# EAGLE design boost (EAGLE 7.5.0)
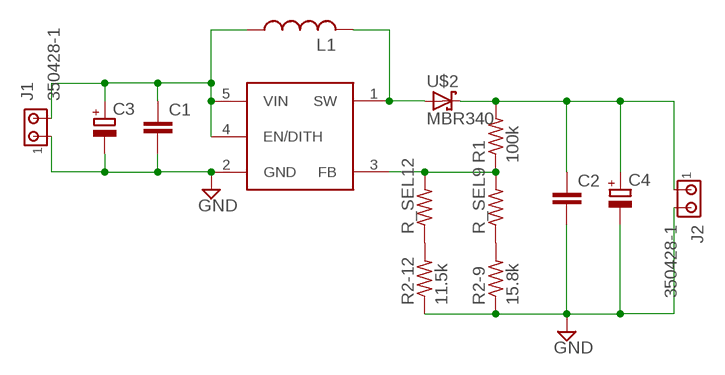
[diagram p0: schematic, sheet 1]

## Parts
C1  C-EUC3216  [C3216]
C2  C-EUC3216  [C3216]
C3  CPOL-EUE1.8-4  [E1,8-4]
C4  CPOL-EUE1.8-4  [E1,8-4]
J1  350428-1  [350428-1]
J2  350428-1  [350428-1]
L1  L-US6000-XXX-RC  [6000-XXXX-RC]
R1  100k  R-US_M0805  [M0805]
R2-9  15.8k  R-US_M0805  [M0805]
R2-12  11.5k  R-US_M0805  [M0805]
R_SEL9  R-US_R0402  [R0402]
R_SEL12  R-US_R0402  [R0402]
U$1  MIC2250-2YD5  [SOT23-5]
U$2  MBR340  [MBR340-V]

## Nets
GND: C1.2 C2.2 C3.- C4.- J1.1 J2.2 R2-9.1 R2-12.1 U$1.2(GND)
N$2: L1.2 U$1.1(SW) U$2.P$1(A)
N$5: R1.1 R_SEL9.2 R_SEL12.2 U$1.3(FB)
N$6: R2-12.2 R_SEL12.1
N$7: R2-9.2 R_SEL9.1
VIN: C1.1 C3.+ J1.2 L1.1 U$1.4(EN/DITH) U$1.5(VIN)
VOUT: C2.1 C4.+ J2.1 R1.2 U$2.P$2(C)

## Library data of the parts
C1 C2 = rcl:C-EU: CAPACITOR, European symbol
C3 C4 = rcl:CPOL-EU: POLARIZED CAPACITOR, European symbol
J1 J2 = con-amp:350428-1: Universal MATE-N-LOK .250" Centerline, 600 V, 19 - 36 A max Source: http://catalog.tycoelectronics.com/ .. ENG_CD_350428_Y.pdf
L1 = rcl:L-US: INDUCTOR, American symbol
R1 R2-9 R2-12 R_SEL9 R_SEL12 = rcl:R-US_: RESISTOR, American symbol
U$1 = pol:MIC2250-2YD5
U$2 = pol:MBR340: Shottky diode 3A

## Board
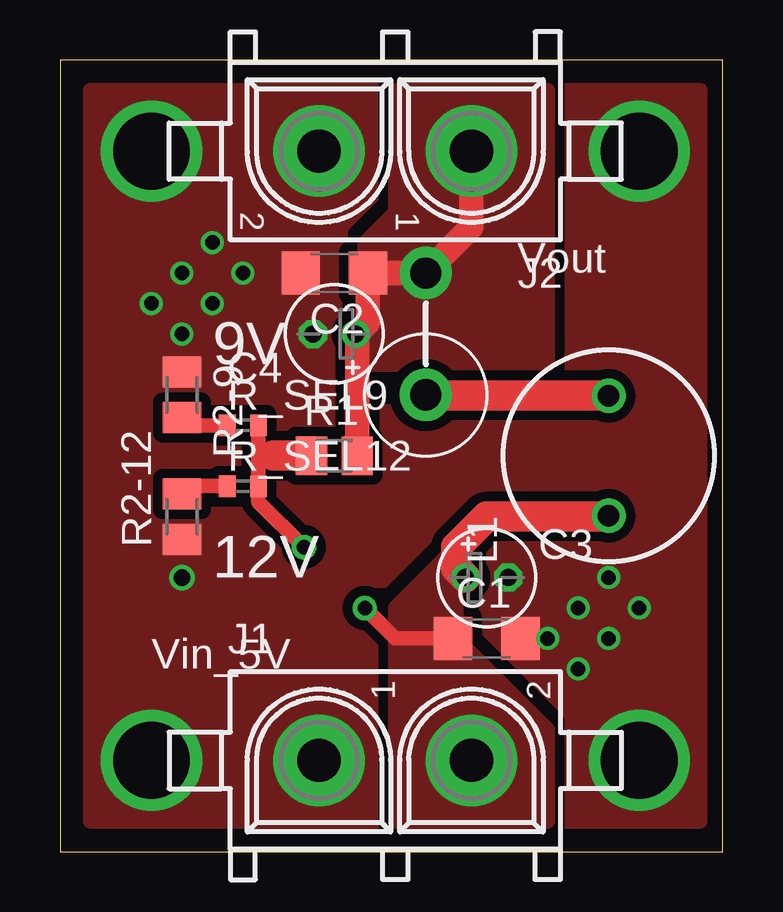
[diagram p1: board, top side]
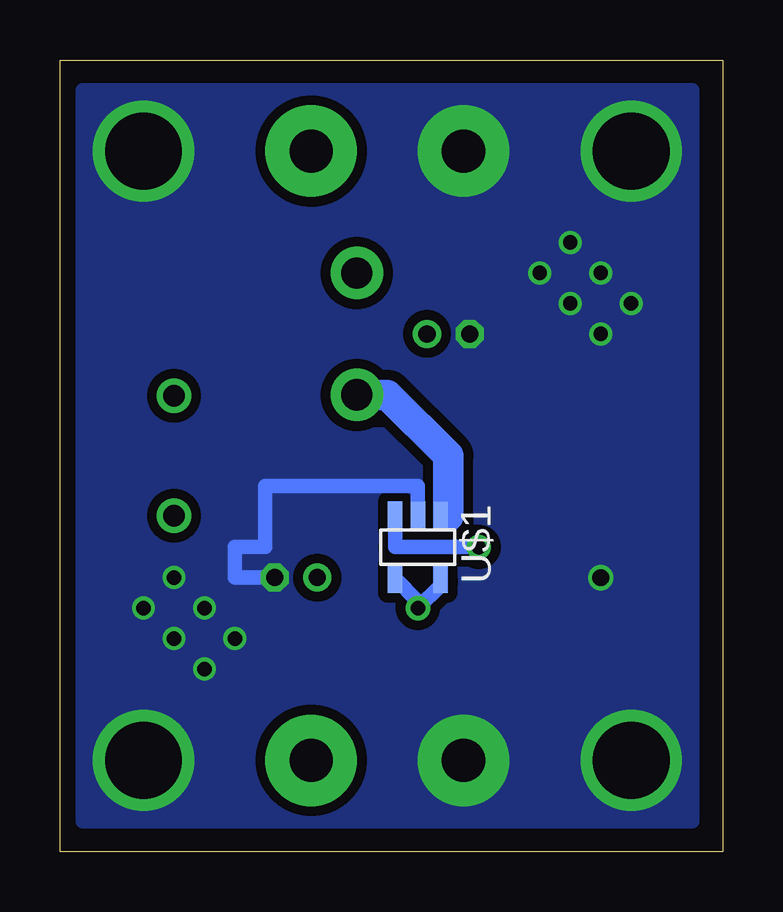
[diagram p2: board, bottom side, seen from below]

Size 27.61 x 33.01 mm. Coordinates in mm from the lower left corner, seen from the top.
Outline: 0,0 27.61,0 27.61,33.01 0,33.01 0,0
Copper layers (1*16): Top 0.0356mm / dielectric 1.5011mm / Bottom 0.0356mm
Design rules "OSH_Park": minimum track width 6mil, minimum drill 13mil, track to track 6mil, track to pad 6mil, pad to pad 6mil, via to via 6mil, smd to smd 6mil, copper to edge 15mil, drill to drill 6mil, minimum pad ring 7mil, minimum via ring 7mil, stop-mask expansion 3mil, vias tented up to drill 0mil, thermal gap 10mil

### Footprints (pad centres in the part's own frame; a part is rotated, then mirrored left to right if it is on the bottom)
C3216 = smd 1.6 x 1.8: 1 -1.4,0; 2 1.4,0
E1,8-4 = drill 0.711 pad 1.168: + -0.889,0 | drill 0.711 pad 1.168 octagon: - 0.889,0
350428-1 = drill 1.8 pad 3.81: 1 -3.175,0; 2 3.175,0
6000-XXXX-RC = drill 0.9 pad 1.422: 1 -2.5,0; 2 2.5,0
M0805 = smd 1.3 x 1.6: 1 -0.95,0; 2 0.95,0
R0402 = smd 0.7 x 0.9: 1 -0.65,0; 2 0.65,0
SOT23-5 = smd 0.6 x 1.2: 1 -0.95,-1.306; 2 0,-1.306; 3 0.95,-1.306; 4 0.95,1.306; 5 -0.95,1.306
MBR340-V = drill 1.3 pad 2.184: P$1 -2.54,0; P$2 2.54,0

### Placement (x,y rotation side)
C1  17.78,8.89 0 top
C2  11.43,24.13 180 top
C3  17.78,11.43 0 top
C4  11.43,21.59 180 top
J1  13.97,3.81 0 top
J2  13.97,29.21 180 top
L1  22.86,16.51 90 top
R1  11.43,16.51 0 top
R2-9  5.08,19.05 270 top
R2-12  5.08,13.97 90 top
R_SEL9  7.62,17.78 0 top
R_SEL12  7.62,15.24 0 top
U$1  12.7,12.7 180 bottom
U$2  15.24,21.59 90 top

### Tracks (layer width: path | path; a pad name or v marks a point on that pad's centre or on a via)
GND  (via drill 0.6, 0.7, 3.2)
  Top 1.27: C2.2 10.16,24.26
  Bottom 0.61: 12.7,13.97 U$1.2 12.7,15.24 19.05,15.24 19.05,12.7 20.32,12.7 20.32,11.43 C3.-
  other vias: 3.81,29.21 24.13,29.21 3.81,3.81 24.13,3.81 5.08,11.43 5.08,24.13 7.62,24.13 5.08,21.59 6.35,22.86 6.35,25.4 3.81,22.86 22.86,11.43 21.59,10.16 20.32,8.89 21.59,7.62 22.86,8.89 24.13,10.16
  pour Bottom (isolate 0.406, no thermals): 1.27,31.75 26.67,31.75 26.67,1.27 1.27,1.27
  pour Top (isolate 0.406, rank 6, no thermals): 1.27,31.75 26.67,31.75 26.67,1.27 1.27,1.27
N$2
  Top 1.27: L1.2 15.24,19.01 U$2.P$1
  Bottom 0.254: 11.43,13.97 11.47,14.01 U$1.1
  Bottom 1.27: 11.43,13.97 11.43,16.51 13.97,19.05 U$2.P$1
N$5  (via drill 0.6 pad 1.02)
  Top 0.406: R1.1 8.27,16.51 R_SEL9.2
  Top 0.61: R_SEL9.2 R_SEL12.2 8.27,14.59 v10.16,12.7
  Top 1.27: 8.89,16.51 R1.1
  Bottom 0.61: U$1.3 13.65,12.7 v10.16,12.7
N$6
  Top 0.61: R_SEL12.1 5.4,15.24 R2-12.2
N$7
  Top 0.61: R_SEL9.1 5.4,17.78 R2-9.2
VIN  (via drill 0.6 pad 1.02)
  Top 0.61: 16.89,9.4 C1.1 13.97,8.89 v12.7,10.16
  Top 1.27: L1.1 22.86,13.97 17.78,13.97 16.51,12.7 16.51,11.81 C3.+
  Bottom 0.61: U$1.5 11.75,11.11 v12.7,10.16 12.7,10.44 U$1.4
  pour Top (isolate 0.406, no thermals): 16.51,12.7 13.97,10.16 13.97,1.27 20.32,1.27 20.32,5.08 16.51,8.89
VOUT
  Top 1.016: C4.+ 12.38,21.59 | 12.38,21.59 R1.2 | 12.38,21.59 12.83,22.04 C2.1 U$2.P$2 17.15,26.04 J2.1
  pour Top (isolate 0.406, no thermals): 20.32,31.75 13.97,31.75 13.97,26.67 12.7,25.4 12.7,20.32 20.32,20.32

### Text on the board
tPlace: Vout | 9V | 12V | Vin_5V